# Altium project CNC_Module_Optical_Encoder.PrjPcb
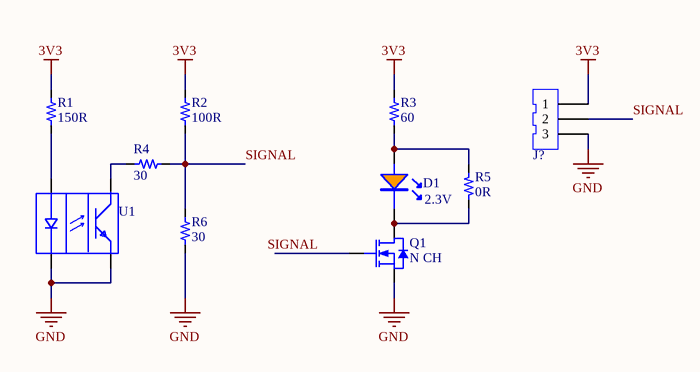
[diagram p0: Optical_Encoder.SchDoc]
1 sheet, 10 parts. Net scope: global (net labels, ports and power ports of the same name join across sheets).
Board file: PCB2.PcbDoc

## Sheet Optical_Encoder.SchDoc
size A4; SheetNumber: 1; SheetTotal: 1

### Parts
D1  2.3V  [0805_LED]
J1  CONN HEADER TH 3POS 2.5mm  [JST_B3B-XH-A]  (value not drawn)
Q1  N CH  [SOT_23_3]
R1  value 150R  [0603_res]  (hidden comment: 150R 1/10W)
R2  value 100R  [0603_res]  (hidden comment: 100R 1/10W)
R3  value 60  [0603_res]  (hidden comment: RES 60Ω ±1% 100mW 0603)
R4  value 30  [0603_res]  (hidden comment: RES 30Ω ±5% 100mW 0603)
R5  value 0R  [0603_res]  (hidden comment: 0R 1/10W)
R6  value 30  [0603_res]  (hidden comment: RES 30Ω ±5% 100mW 0603)
U1  SENSOR OPT SLOT PHOTOTRAN PCB MT  [RPI-441C1E]  (value not drawn)

### Nets
3V3: J1.1 R1.2 R2.2 R3.2
GND: J1.3 Q1.2(S) R6.1 U1.1(CATHODE) U1.4(EMISOR)
SIGNAL: J1.2 Q1.1(G) R2.1 R4.2 R6.2
NetD1_1: D1.1(A) R3.1 R5.2
NetD1_2: D1.2 Q1.3(D) R5.1
NetR1_1: R1.1 U1.2(ANODE)
NetR4_1: R4.1 U1.3(COLLECTOR)

### Library data of the parts
D1 = LED_0805_Orange: LED ORANGE WATER CLEAR 0805 SMD; Manufacturer: XINGLIGHT; Manufacturer Part Number: XL-2012UOC; Supplier 1: LCSC; Supplier Part Number 1: C965813; ComponentLink1Description: LCSC; ComponentLink1URL: https://www.lcsc.com/product-detail/C965813.html?s_z=n_XINGLIGHT%2520XL-2012
J1 = Connector JST 3pin: 3P 1x3P XH Tin -25℃~+85℃ White 2.5mm 250V 3 3A 1 Through Hole Through Hole,P=2.5mm Headers, Male Pins RoHS; Manufacturer: JST; Manufacturer Part Number: B3B-XH-A(LF)(SN); Supplier 1: LCSC; Supplier Part Number 1: C144394; ComponentLink1Description: LCSC; ComponentLink1URL: https://www.lcsc.com/product-detail/C144394.html?s_z=n_JST%2520b3
Q1 = Q_NFET_50V_200mA_SOT23: MOSFET N-CH 50V 200mA SOT-23; Manufacturer: onsemi; Manufacturer Part Number: BSS138LT1G; Supplier 1: LCSC; Supplier Part Number 1: C82045; ComponentLink1Description: LCSC; ComponentLink1URL: https://www.lcsc.com/product-detail/C82045.html
R1 = Res_150R_0603_1/10W: 100mW Thick Film Resistor 75V ±100ppm/℃ ±1% 150Ω 0603 Chip Resistor - Surface Mount ROHS; Manufacturer: RALEC; Manufacturer Part Number: RTT031500FTP; ComponentLink1URL: https://lcsc.com/product-detail/Chip-Resistor-Surface-Mount_RALEC-RTT031500FTP_C103302.html; Supplier 1: LCSC; Supplier Part Number 1: C103302; ComponentLink1Description: LCSC
R2 = Res_100R_0603_1/10W: RES SMD 100R OHM 5% 1/10W 0603; Manufacturer: FOJAN; Manufacturer Part Number: FRC0603J101 TS; ComponentLink1URL: https://www.lcsc.com/product-detail/Chip-Resistor-Surface-Mount_FOJAN-FRC0603J101-TS_C2907089.html; Supplier 1: LCSC; Supplier Part Number 1: C2907089; ComponentLink1Description: LCSC
R3 = Res_60_0603_1/10W: 100mW 60Ω 75V ±100ppm/℃ Thick Film Resistor ±1% 0603 Chip Resistor - Surface Mount RoHS; Manufacturer: RALEC; Manufacturer Part Number: RTT0360R0FTP; ComponentLink1URL: https://www.lcsc.com/product-detail/Chip-Resistor-Surface-Mount_FOJAN-FRC0603J102-TS_C2907113.html; Supplier 1: LCSC; Supplier Part Number 1: C166918; ComponentLink1Description: LCSC
R4 R6 = Res_30_0603_1/10W: 100mW 30Ω 75V ±100ppm/℃ Thick Film Resistor ±5% 0603 Chip Resistor - Surface Mount RoHS; Manufacturer: FOJAN; Manufacturer Part Number: FRC0603J300 TS; ComponentLink1URL: https://www.lcsc.com/product-detail/Chip-Resistor-Surface-Mount_FOJAN-FRC0603J102-TS_C2907113.html; Supplier 1: LCSC; Supplier Part Number 1: C2907150; ComponentLink1Description: LCSC
R5 = Res_0R_0603_1/10W: RES SMD 0R OHM 5% 1/10W 0603; Manufacturer: FOJAN; Manufacturer Part Number: FRC0603P000 TS; ComponentLink1URL: https://www.lcsc.com/product-detail/Chip-Resistor-Surface-Mount_FOJAN-FRC0603P000-TS_C2907080.html; Supplier 1: LCSC; Supplier Part Number 1: C2907080; ComponentLink1Description: LCSC
U1 = RPI-441C1E: 850nm 1.4V DIP-4 Photointerrupters - Slot Type - Transistor Output RoHS; Manufacturer: ROHM; Supplier 1: LCSC; Supplier Part Number 1: C919442; Manufacturer Part Number: RPI-441C1E; ComponentLink1Description: LCSC; ComponentLink1URL: https://www.lcsc.com/product-detail/C919442.html?s_z=n_RPI-441C1